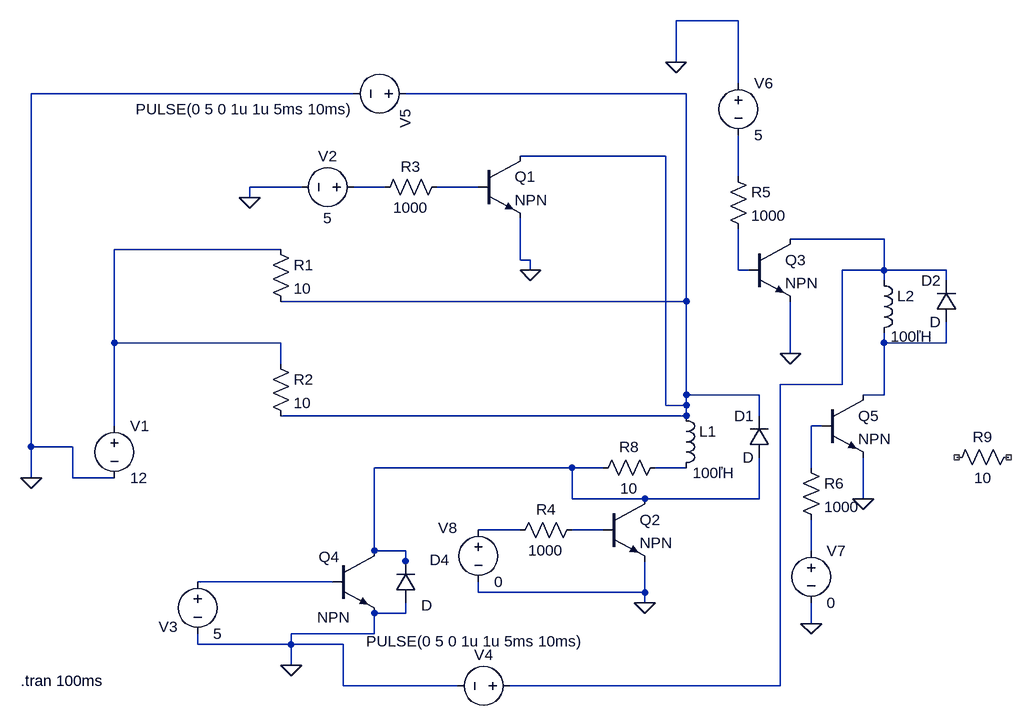
[diagram p0: schematic Final simulation to understand the V&A.asc]
Final simulation to understand the V&A.asc, the LTspice schematic file:
Version 4
SHEET 1 1320 880
WIRE 848 -464 752 -464
WIRE 752 -400 752 -464
WIRE 848 -368 848 -464
WIRE 256 -352 -240 -352
WIRE 768 -352 336 -352
WIRE 736 -256 512 -256
WIRE 848 -224 848 -288
WIRE 176 -208 96 -208
WIRE 304 -208 256 -208
WIRE 448 -208 384 -208
WIRE 96 -192 96 -208
WIRE 1072 -128 928 -128
WIRE 144 -112 -112 -112
WIRE 512 -96 512 -160
WIRE 528 -96 512 -96
WIRE 528 -80 528 -96
WIRE 848 -80 848 -144
WIRE 864 -80 848 -80
WIRE 1072 -80 1072 -128
WIRE 1072 -80 1008 -80
WIRE 1168 -80 1072 -80
WIRE 1072 -64 1072 -80
WIRE 1168 -64 1168 -80
WIRE 768 -32 768 -352
WIRE 768 -32 144 -32
WIRE -112 32 -112 -112
WIRE 144 32 -112 32
WIRE 1072 32 1072 16
WIRE 1168 32 1168 0
WIRE 1168 32 1072 32
WIRE 928 48 928 -32
WIRE 144 64 144 32
WIRE 1008 96 1008 -80
WIRE 1008 96 912 96
WIRE 768 112 768 -32
WIRE 880 112 768 112
WIRE 1072 112 1072 32
WIRE 1072 112 1040 112
WIRE 736 128 736 -256
WIRE 768 128 768 112
WIRE 768 128 736 128
WIRE 768 144 768 128
WIRE 768 144 144 144
WIRE 880 144 880 112
WIRE -112 160 -112 32
WIRE 976 160 960 160
WIRE -240 192 -240 -352
WIRE -176 192 -240 192
WIRE 592 224 288 224
WIRE 640 224 592 224
WIRE 768 224 720 224
WIRE 960 224 960 160
WIRE -240 240 -240 192
WIRE -176 240 -176 192
WIRE -112 240 -176 240
WIRE 592 272 592 224
WIRE 704 272 592 272
WIRE 880 272 880 208
WIRE 880 272 704 272
WIRE 1040 272 1040 208
WIRE 512 320 448 320
WIRE 640 320 592 320
WIRE 288 352 288 224
WIRE 336 352 288 352
WIRE 960 352 960 304
WIRE 336 368 336 352
WIRE 336 384 336 368
WIRE 224 400 16 400
WIRE 448 416 448 400
WIRE 704 416 704 368
WIRE 704 416 448 416
WIRE 704 432 704 416
WIRE 336 448 336 432
WIRE 336 448 288 448
WIRE 960 464 960 432
WIRE 288 480 288 448
WIRE 288 480 160 480
WIRE 16 496 16 480
WIRE 160 496 160 480
WIRE 160 496 16 496
WIRE 240 496 160 496
WIRE 160 528 160 496
WIRE 240 560 240 496
WIRE 416 560 240 560
WIRE 912 560 912 96
WIRE 912 560 496 560
FLAG -240 240 0
FLAG 160 528 0
FLAG 528 -80 0
FLAG 96 -192 0
FLAG 704 432 0
FLAG 928 48 0
FLAG 1040 272 0
FLAG 960 464 0
FLAG 752 -400 0
SYMBOL npn 224 352 R0
WINDOW 0 -22 9 Left 2
WINDOW 3 -24 102 Left 2
SYMATTR InstName Q4
SYMBOL res 128 -128 R0
SYMATTR InstName R1
SYMATTR Value 10
SYMBOL res 128 48 R0
SYMATTR InstName R2
SYMATTR Value 10
SYMBOL ind 752 128 R0
WINDOW 3 26 104 Left 2
SYMATTR InstName L1
SYMATTR Value 100ľH
SYMBOl voltage -112 144 R0
WINDOW 123 0 0 Left 0
WINDOW 39 0 0 Left 0
SYMATTR InstName V1
SYMATTR Value 12
SYMBOL voltage 16 384 R0
WINDOW 0 -60 85 Left 2
WINDOW 123 0 0 Left 0
WINDOW 39 0 0 Left 0
SYMATTR InstName V3
SYMATTR Value 5
SYMBOL diode 352 432 R180
WINDOW 0 -52 66 Left 2
WINDOW 3 -25 -4 Left 2
SYMATTR InstName D4
SYMBOL npn 448 -256 R0
SYMATTR InstName Q1
SYMBOL npn 640 272 R0
SYMATTR InstName Q2
SYMBOL npn 864 -128 R0
SYMATTR InstName Q3
SYMBOL npn 976 112 R0
SYMATTR InstName Q5
SYMBOL ind 1056 -80 R0
WINDOW 3 26 102 Left 2
SYMATTR InstName L2
SYMATTR Value 100ľH
SYMBOL diode 896 208 R180
WINDOW 0 24 64 Left 2
WINDOW 3 24 0 Left 2
SYMATTR InstName D1
SYMBOL diode 1184 0 R180
WINDOW 0 24 64 Left 2
WINDOW 3 24 0 Left 2
SYMATTR InstName D2
SYMBOL res 400 -224 R90
WINDOW 0 0 56 VBottom 2
WINDOW 3 32 56 VTop 2
SYMATTR InstName R3
SYMATTR Value 1000
SYMBOL res 608 304 R90
WINDOW 0 0 56 VBottom 2
WINDOW 3 32 56 VTop 2
SYMATTR InstName R4
SYMATTR Value 1000
SYMBOL res 832 -240 R0
SYMATTR InstName R5
SYMATTR Value 1000
SYMBOL res 944 208 R0
SYMATTR InstName R6
SYMATTR Value 1000
SYMBOL voltage 272 -208 R90
WINDOW 0 -32 56 VBottom 2
WINDOW 3 32 56 VTop 2
WINDOW 123 0 0 Left 0
WINDOW 39 0 0 Left 0
SYMATTR InstName V2
SYMATTR Value 5
SYMBOL voltage 512 560 R90
WINDOW 0 -32 56 VBottom 2
WINDOW 3 -84 69 VTop 2
WINDOW 123 0 0 Left 0
WINDOW 39 0 0 Left 0
SYMATTR InstName V4
SYMATTR Value PULSE(0 5 0 1u 1u 5ms 10ms)
SYMBOL voltage 352 -352 R90
WINDOW 3 24 97 VRight 2
WINDOW 123 0 0 Left 0
WINDOW 39 0 0 Left 0
SYMATTR InstName V5
SYMATTR Value PULSE(0 5 0 1u 1u 5ms 10ms)
SYMBOL voltage 848 -384 R0
WINDOW 123 0 0 Left 0
WINDOW 39 0 0 Left 0
SYMATTR InstName V6
SYMATTR Value 5
SYMBOL voltage 960 336 R0
WINDOW 123 0 0 Left 0
WINDOW 39 0 0 Left 0
SYMATTR InstName V7
SYMATTR Value 0
SYMBOL voltage 448 304 R0
WINDOW 0 -62 13 Left 2
WINDOW 123 0 0 Left 0
WINDOW 39 0 0 Left 0
SYMATTR InstName V8
SYMATTR Value 0
SYMBOL res 736 208 R90
WINDOW 0 0 56 VBottom 2
WINDOW 3 32 56 VTop 2
SYMATTR InstName R8
SYMATTR Value 10
SYMBOL res 1280 192 R90
WINDOW 0 0 56 VBottom 2
WINDOW 3 32 56 VTop 2
SYMATTR InstName R9
SYMATTR Value 10
TEXT -256 552 Left 2 !.tran 100ms

The netlist it stands for:
* Final simulation to understand the V&A.asc
Q4 N010 N015 0 0 NPN
R1 N006 N001 10
R2 N006 N001 10
L1 N001 N011 100ľH
V1 N006 0 12
V3 N015 0 5
D4 0 N010 D
Q1 N001 N004 0 0 NPN
Q2 N010 N013 0 0 NPN
Q3 N005 N007 0 0 NPN
Q5 N008 N009 0 0 NPN
L2 N005 N008 100ľH
D1 N010 N001 D
D2 N008 N005 D
R3 N004 N003 1000
R4 N013 N012 1000
R5 N002 N007 1000
R6 N009 N014 1000
V2 N003 0 5
V4 N005 0 PULSE(0 5 0 1u 1u 5ms 10ms)
V5 N001 0 PULSE(0 5 0 1u 1u 5ms 10ms)
V6 0 N002 5
V7 N014 0 0
V8 N012 0 0
R8 N011 N010 10
R9 NC_01 NC_02 10
.model D D
.lib standard.dio
.model NPN NPN
.model PNP PNP
.lib standard.bjt
.tran 100ms
.backanno
.end